# Altium schematic sheet Logo_led.SchDoc
size A
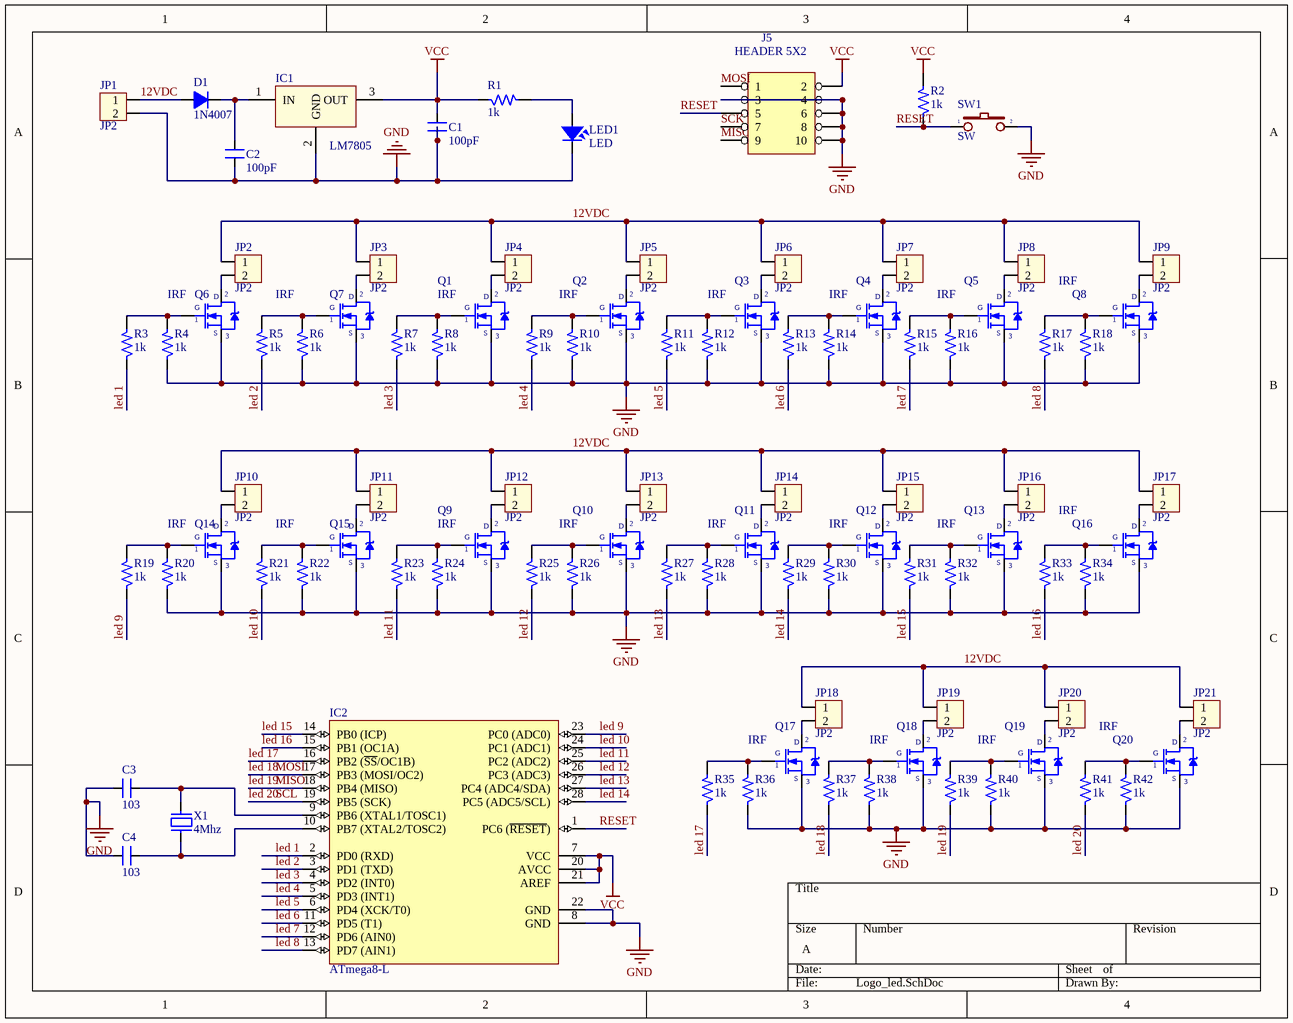
[diagram p0: Logo_led.SchDoc]

## Parts
C1  100pF  [CN1]
C2  100pF  [CN1]
C3  103  [SM-0805]
C4  103  [SM-0805]
D1  1N4007  [D1A]
IC1  LM7805  [QTO-220]
IC2  ATmega8-L  [DIP28/W0.3]
J5  HEADER 5X2  [IDC10]
JP1  JP2  [CON2]
JP2  JP2  [CON2]
JP3  JP2  [CON2]
JP4  JP2  [CON2]
JP5  JP2  [CON2]
JP6  JP2  [CON2]
JP7  JP2  [CON2]
JP8  JP2  [CON2]
JP9  JP2  [CON2]
JP10  JP2  [CON2]
JP11  JP2  [CON2]
JP12  JP2  [CON2]
JP13  JP2  [CON2]
JP14  JP2  [CON2]
JP15  JP2  [CON2]
JP16  JP2  [CON2]
JP17  JP2  [CON2]
JP18  JP2  [CON2]
JP19  JP2  [CON2]
JP20  JP2  [CON2]
JP21  JP2  [CON2]
LED1  LED  [LED-3]
Q1  IRF  [QTO-220]
Q2  IRF  [QTO-220]
Q3  IRF  [QTO-220]
Q4  IRF  [QTO-220]
Q5  IRF  [QTO-220]
Q6  IRF  [QTO-220]
Q7  IRF  [QTO-220]
Q8  IRF  [QTO-220]
Q9  IRF  [QTO-220]
Q10  IRF  [QTO-220]
Q11  IRF  [QTO-220]
Q12  IRF  [QTO-220]
Q13  IRF  [QTO-220]
Q14  IRF  [QTO-220]
Q15  IRF  [QTO-220]
Q16  IRF  [QTO-220]
Q17  IRF  [QTO-220]
Q18  IRF  [QTO-220]
Q19  IRF  [QTO-220]
Q20  IRF  [QTO-220]
R1  1k  [SM-1206]
R2  1k  [SM-1206]
R3  1k  [SM-1206]
R4  1k  [SM-1206]
R5  1k  [SM-1206]
R6  1k  [SM-1206]
R7  1k  [SM-1206]
R8  1k  [SM-1206]
R9  1k  [SM-1206]
R10  1k  [SM-1206]
R11  1k  [SM-1206]
R12  1k  [SM-1206]
R13  1k  [SM-1206]
R14  1k  [SM-1206]
R15  1k  [SM-1206]
R16  1k  [SM-1206]
R17  1k  [SM-1206]
R18  1k  [SM-1206]
R19  1k  [SM-1206]
R20  1k  [SM-1206]
R21  1k  [SM-1206]
R22  1k  [SM-1206]
R23  1k  [SM-1206]
R24  1k  [SM-1206]
R25  1k  [SM-1206]
R26  1k  [SM-1206]
R27  1k  [SM-1206]
R28  1k  [SM-1206]
R29  1k  [SM-1206]
R30  1k  [SM-1206]
R31  1k  [SM-1206]
R32  1k  [SM-1206]
R33  1k  [SM-1206]
R34  1k  [SM-1206]
R35  1k  [SM-1206]
R36  1k  [SM-1206]
R37  1k  [SM-1206]
R38  1k  [SM-1206]
R39  1k  [SM-1206]
R40  1k  [SM-1206]
R41  1k  [SM-1206]
R42  1k  [SM-1206]
SW1  SW  [SW2]
X1  4Mhz  [XT2]

## Nets
GND: C1.1 C2.1 C3.2 C4.2 IC1.2(GND) IC2.8(GND) IC2.22(GND) J5.3 J5.4 J5.6 J5.8 J5.10 JP1.2 LED1.2 Q1.3(S) Q2.3(S) Q3.3(S) Q4.3(S) Q5.3(S) Q6.3(S) Q7.3(S) Q8.3(S) Q9.3(S) Q10.3(S) Q11.3(S) Q12.3(S) Q13.3(S) Q14.3(S) Q15.3(S) Q16.3(S) Q17.3(S) Q18.3(S) Q19.3(S) Q20.3(S) R4.1 R6.1 R8.1 R10.1 R12.1 R14.1 R16.1 R18.1 R20.1 R22.1 R24.1 R26.1 R28.1 R30.1 R32.1 R34.1 R36.1 R38.1 R40.1 R42.1 SW1.2
VCC: C1.2 IC1.3(OUT) IC2.7(VCC) IC2.20(AVCC) IC2.21(AREF) J5.2 R1.1 R2.2
12VDC: D1.1(A) JP1.1 JP2.1 JP3.1 JP4.1 JP5.1 JP6.1 JP7.1 JP8.1 JP9.1 JP10.1 JP11.1 JP12.1 JP13.1 JP14.1 JP15.1 JP16.1 JP17.1 JP18.1 JP19.1 JP20.1 JP21.1
led 1: IC2.2(PD0_(RXD)) R3.1
led 2: IC2.3(PD1_(TXD)) R5.1
led 3: IC2.4(PD2_(INT0)) R7.1
led 4: IC2.5(PD3_(INT1)) R9.1
led 5: IC2.6(PD4_(XCK/T0)) R11.1
led 6: IC2.11(PD5_(T1)) R13.1
led 7: IC2.12(PD6_(AIN0)) R15.1
led 8: IC2.13(PD7_(AIN1)) R17.1
led 9: IC2.23(PC0_(ADC0)) R19.1
led 10: IC2.24(PC1_(ADC1)) R21.1
led 11: IC2.25(PC2_(ADC2)) R23.1
led 12: IC2.26(PC3_(ADC3)) R25.1
led 13: IC2.27(PC4_(ADC4/SDA)) R27.1
led 14: IC2.28(PC5_(ADC5/SCL)) R29.1
led 15: IC2.14(PB0_(ICP)) R31.1
led 16: IC2.15(PB1_(OC1A)) R33.1
led 17: IC2.16(PB2_(~{SS}/OC1B)) R35.1
led 18: IC2.17(PB3_(MOSI/OC2)) J5.1 R37.1  [also labelled MOSI]
led 19: IC2.18(PB4_(MISO)) J5.9 R39.1  [also labelled MISO]
led 20: IC2.19(PB5_(SCK)) R41.1  [also labelled SCL]
RESET: IC2.1(PC6_(~{RESET})) J5.5 R2.1 SW1.1
SCK: J5.7
NetC2_2: C2.2 D1.2(K) IC1.1(IN)
NetC3_1: C3.1 IC2.9(PB6_(XTAL1/TOSC1)) X1.2
NetC4_1: C4.1 IC2.10(PB7_(XTAL2/TOSC2)) X1.1
NetJP2_2: JP2.2 Q6.2(D)
NetJP3_2: JP3.2 Q7.2(D)
NetJP4_2: JP4.2 Q1.2(D)
NetJP5_2: JP5.2 Q2.2(D)
NetJP6_2: JP6.2 Q3.2(D)
NetJP7_2: JP7.2 Q4.2(D)
NetJP8_2: JP8.2 Q5.2(D)
NetJP9_2: JP9.2 Q8.2(D)
NetJP10_2: JP10.2 Q14.2(D)
NetJP11_2: JP11.2 Q15.2(D)
NetJP12_2: JP12.2 Q9.2(D)
NetJP13_2: JP13.2 Q10.2(D)
NetJP14_2: JP14.2 Q11.2(D)
NetJP15_2: JP15.2 Q12.2(D)
NetJP16_2: JP16.2 Q13.2(D)
NetJP17_2: JP17.2 Q16.2(D)
NetJP18_2: JP18.2 Q17.2(D)
NetJP19_2: JP19.2 Q18.2(D)
NetJP20_2: JP20.2 Q19.2(D)
NetJP21_2: JP21.2 Q20.2(D)
NetLED1_1: LED1.1 R1.2
NetQ1_1: Q1.1(G) R7.2 R8.2
NetQ2_1: Q2.1(G) R9.2 R10.2
NetQ3_1: Q3.1(G) R11.2 R12.2
NetQ4_1: Q4.1(G) R13.2 R14.2
NetQ5_1: Q5.1(G) R15.2 R16.2
NetQ6_1: Q6.1(G) R3.2 R4.2
NetQ7_1: Q7.1(G) R5.2 R6.2
NetQ8_1: Q8.1(G) R17.2 R18.2
NetQ9_1: Q9.1(G) R23.2 R24.2
NetQ10_1: Q10.1(G) R25.2 R26.2
NetQ11_1: Q11.1(G) R27.2 R28.2
NetQ12_1: Q12.1(G) R29.2 R30.2
NetQ13_1: Q13.1(G) R31.2 R32.2
NetQ14_1: Q14.1(G) R19.2 R20.2
NetQ15_1: Q15.1(G) R21.2 R22.2
NetQ16_1: Q16.1(G) R33.2 R34.2
NetQ17_1: Q17.1(G) R35.2 R36.2
NetQ18_1: Q18.1(G) R37.2 R38.2
NetQ19_1: Q19.1(G) R39.2 R40.2
NetQ20_1: Q20.1(G) R41.2 R42.2

## Library data of the parts
C1 C2 = CN1: Cap np  1pF - 472pF; Value: 100pF
C3 C4 = CM: Cap SMD; Value: 103
D1 = D1A: Diode 1A; Value: 1N4007
IC1 = LM78xx: On ap +, from + 5 to + 24VDC; Value: LM7805
IC2 = ATmega8-L: 8-Bit AVR Microcontroller with 8K Bytes of In-System Programmable Flash Memory; Value: ATmega8-L
JP1-JP21 = Con2: Connector 2; Value: Connector 2
LED1 = LED: LED Single colour Green and Red; Value: LED 3 ly Single Colour
Q1-Q20 = IRF840: MOSFET N - CHANNEL 500V - 0.75 - 8A - TO-220; Value: IRF840
R1-R42 = R: Resistor 1/4W; Value: R1/4W - 1K
SW1 = SW2: Switch button 2 pin; Value: SW chip 2 pin
X1 = XT2: Crystal For all Crystal 2pin.; Value: 4Mhz